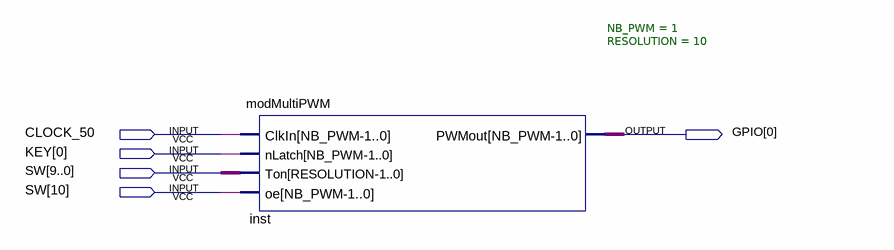
[diagram p0: schematic sheet]
// Quartus schematic Test_PWM.bdf as structural Verilog: 1 symbols, 5 pins
module Test_PWM (
  input  CLOCK_50,
  input  [0:0] KEY,
  input  [10:0] SW,
  output [0:0] GPIO
);

  modMultiPWM #(.NB_PWM(1), .RESOLUTION(10)) inst (
    .ClkIn(CLOCK_50), .nLatch(KEY[0]), .Ton(SW[9:0]), .oe(SW[10]), .PWMout(GPIO[0]));
endmodule
